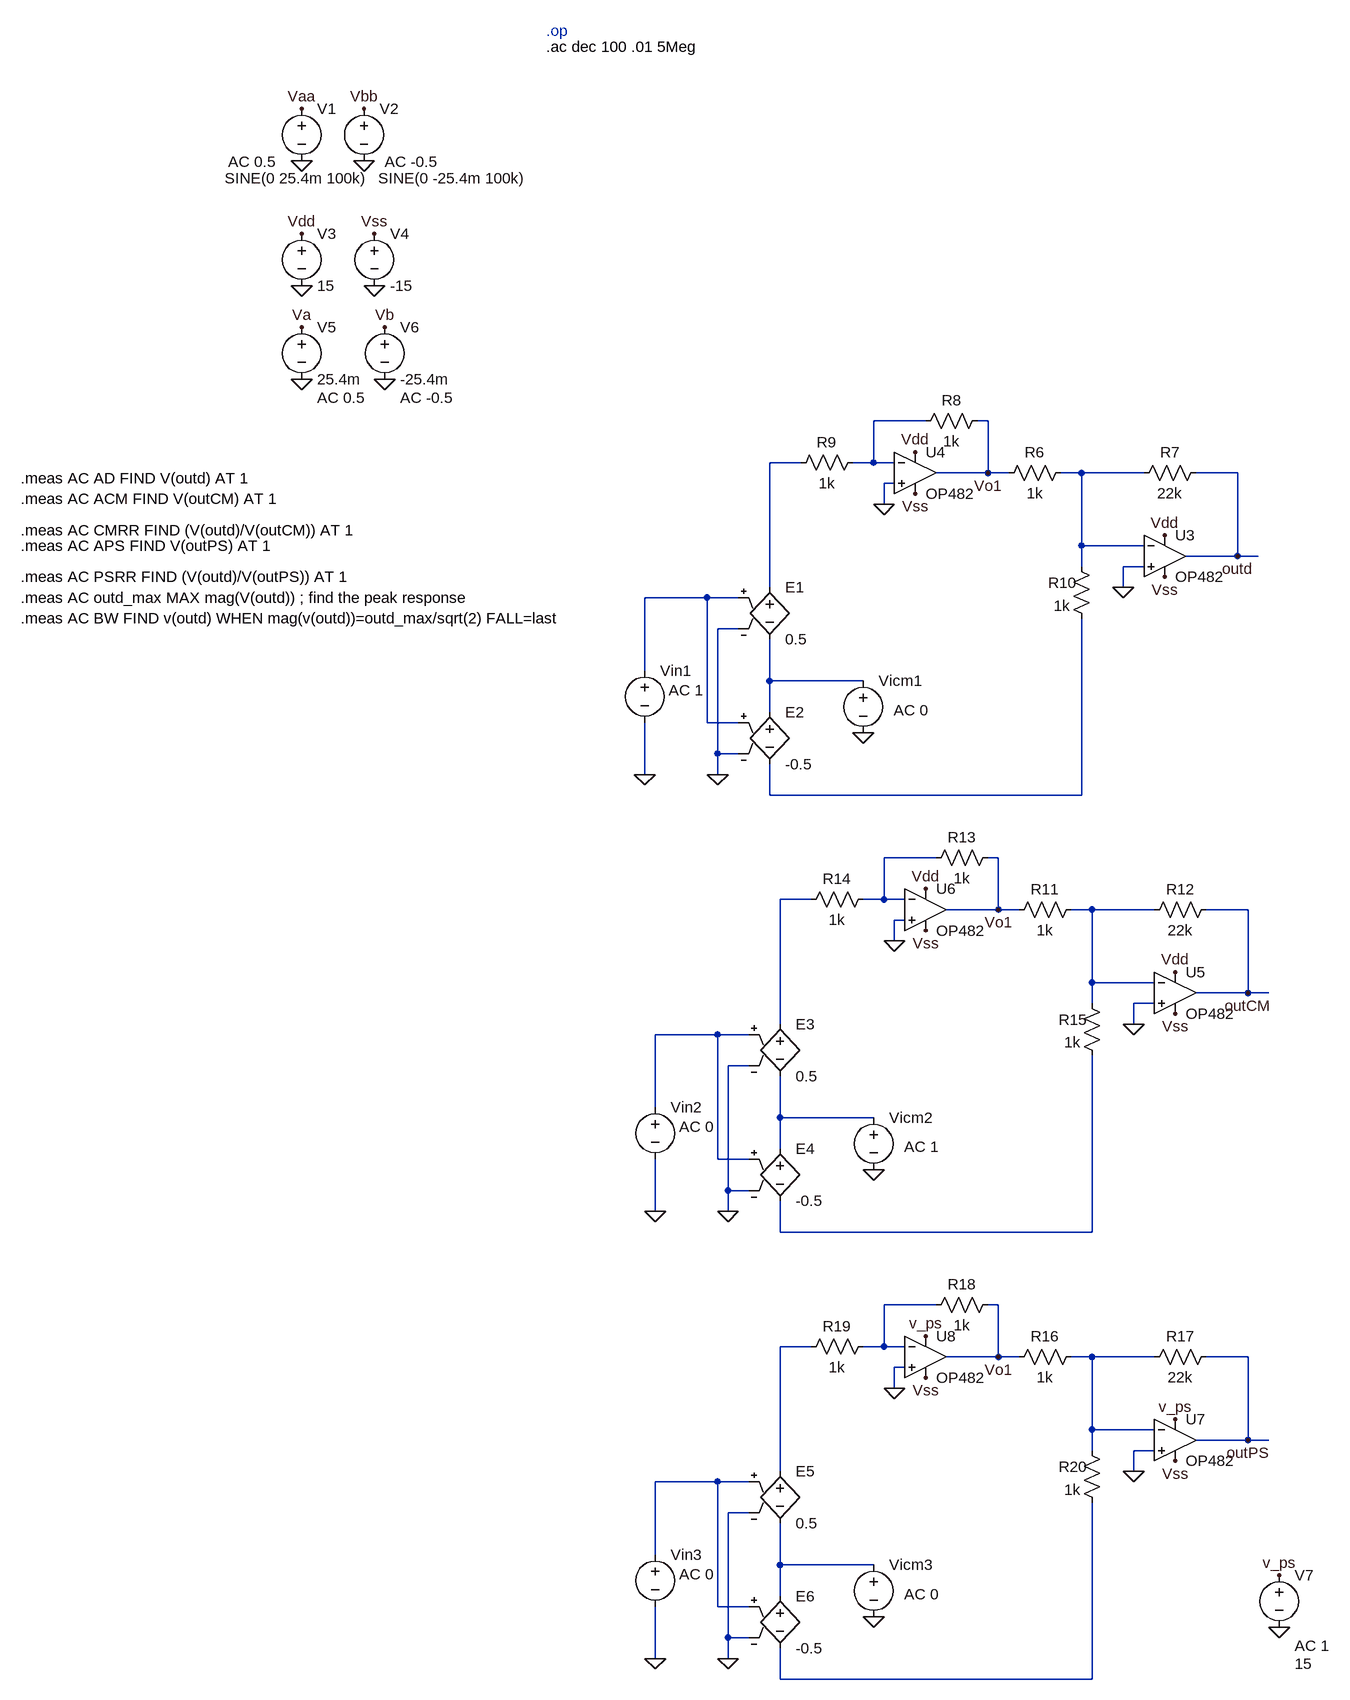
[diagram p0: schematic Et_1_CMRR+PSRR.asc]
Et_1_CMRR+PSRR.asc, the LTspice schematic file:
Version 4
SHEET 1 1392 2468
WIRE 768 528 688 528
WIRE 864 528 848 528
WIRE 576 592 528 592
WIRE 688 592 688 528
WIRE 688 592 656 592
WIRE 720 592 688 592
WIRE 864 608 864 528
WIRE 864 608 784 608
WIRE 896 608 864 608
WIRE 1008 608 976 608
WIRE 1104 608 1008 608
WIRE 1248 608 1184 608
WIRE 720 624 704 624
WIRE 704 656 704 624
WIRE 1008 720 1008 608
WIRE 1104 720 1008 720
WIRE 1248 736 1248 608
WIRE 1248 736 1168 736
WIRE 1280 736 1248 736
WIRE 1008 752 1008 720
WIRE 1104 752 1072 752
WIRE 528 784 528 592
WIRE 1072 784 1072 752
WIRE 432 800 336 800
WIRE 480 800 432 800
WIRE 480 848 448 848
WIRE 336 912 336 800
WIRE 528 928 528 864
WIRE 672 928 528 928
WIRE 528 976 528 928
WIRE 432 992 432 800
WIRE 480 992 432 992
WIRE 448 1040 448 848
WIRE 480 1040 448 1040
WIRE 336 1072 336 992
WIRE 448 1072 448 1040
WIRE 528 1104 528 1056
WIRE 1008 1104 1008 832
WIRE 1008 1104 528 1104
WIRE 784 1200 704 1200
WIRE 880 1200 864 1200
WIRE 592 1264 544 1264
WIRE 704 1264 704 1200
WIRE 704 1264 672 1264
WIRE 736 1264 704 1264
WIRE 880 1280 880 1200
WIRE 880 1280 800 1280
WIRE 912 1280 880 1280
WIRE 1024 1280 992 1280
WIRE 1120 1280 1024 1280
WIRE 1264 1280 1200 1280
WIRE 736 1296 720 1296
WIRE 720 1328 720 1296
WIRE 1024 1392 1024 1280
WIRE 1120 1392 1024 1392
WIRE 1264 1408 1264 1280
WIRE 1264 1408 1184 1408
WIRE 1296 1408 1264 1408
WIRE 1024 1424 1024 1392
WIRE 1120 1424 1088 1424
WIRE 544 1456 544 1264
WIRE 1088 1456 1088 1424
WIRE 448 1472 352 1472
WIRE 496 1472 448 1472
WIRE 496 1520 464 1520
WIRE 352 1584 352 1472
WIRE 544 1600 544 1536
WIRE 688 1600 544 1600
WIRE 544 1648 544 1600
WIRE 448 1664 448 1472
WIRE 496 1664 448 1664
WIRE 464 1712 464 1520
WIRE 496 1712 464 1712
WIRE 352 1744 352 1664
WIRE 464 1744 464 1712
WIRE 544 1776 544 1728
WIRE 1024 1776 1024 1504
WIRE 1024 1776 544 1776
WIRE 784 1888 704 1888
WIRE 880 1888 864 1888
WIRE 592 1952 544 1952
WIRE 704 1952 704 1888
WIRE 704 1952 672 1952
WIRE 736 1952 704 1952
WIRE 880 1968 880 1888
WIRE 880 1968 800 1968
WIRE 912 1968 880 1968
WIRE 1024 1968 992 1968
WIRE 1120 1968 1024 1968
WIRE 1264 1968 1200 1968
WIRE 736 1984 720 1984
WIRE 720 2016 720 1984
WIRE 1024 2080 1024 1968
WIRE 1120 2080 1024 2080
WIRE 1264 2096 1264 1968
WIRE 1264 2096 1184 2096
WIRE 1296 2096 1264 2096
WIRE 1024 2112 1024 2080
WIRE 1120 2112 1088 2112
WIRE 544 2144 544 1952
WIRE 1088 2144 1088 2112
WIRE 448 2160 352 2160
WIRE 496 2160 448 2160
WIRE 496 2208 464 2208
WIRE 352 2272 352 2160
WIRE 544 2288 544 2224
WIRE 688 2288 544 2288
WIRE 544 2336 544 2288
WIRE 448 2352 448 2160
WIRE 496 2352 448 2352
WIRE 464 2400 464 2208
WIRE 496 2400 464 2400
WIRE 352 2432 352 2352
WIRE 464 2432 464 2400
WIRE 544 2464 544 2416
WIRE 1024 2464 1024 2192
WIRE 1024 2464 544 2464
FLAG -192 128 0
FLAG -96 128 0
FLAG -192 320 0
FLAG -80 320 0
FLAG -192 48 Vaa
FLAG -96 48 Vbb
FLAG -192 240 Vdd
FLAG -80 240 Vss
FLAG 704 656 0
FLAG 1072 784 0
FLAG 752 576 Vdd
FLAG 752 640 Vss
FLAG 1136 704 Vdd
FLAG 1136 768 Vss
FLAG 864 608 Vo1
FLAG 672 1008 0
FLAG 336 1072 0
FLAG 448 1072 0
FLAG 1248 736 outd
FLAG 720 1328 0
FLAG 1088 1456 0
FLAG 768 1248 Vdd
FLAG 768 1312 Vss
FLAG 1152 1376 Vdd
FLAG 1152 1440 Vss
FLAG 880 1280 Vo1
FLAG 688 1680 0
FLAG 352 1744 0
FLAG 464 1744 0
FLAG 1264 1408 outCM
FLAG 720 2016 0
FLAG 1088 2144 0
FLAG 768 2000 Vss
FLAG 1152 2128 Vss
FLAG 880 1968 Vo1
FLAG 688 2368 0
FLAG 352 2432 0
FLAG 464 2432 0
FLAG 1264 2096 outPS
FLAG 1312 2384 0
FLAG 1312 2304 v_ps
FLAG 1152 2064 v_ps
FLAG 768 1936 v_ps
FLAG -192 384 Va
FLAG -64 384 Vb
FLAG -192 464 0
FLAG -64 464 0
SYMBOL voltage -192 32 R0
WINDOW 3 -118 123 Left 2
WINDOW 123 -113 97 Left 2
WINDOW 39 0 0 Left 0
SYMATTR Value SINE(0 25.4m 100k)
SYMATTR Value2 AC 0.5
SYMATTR InstName V1
SYMBOL voltage -96 32 R0
WINDOW 3 22 123 Left 2
WINDOW 123 32 97 Left 2
WINDOW 39 0 0 Left 0
SYMATTR Value SINE(0 -25.4m 100k)
SYMATTR Value2 AC -0.5
SYMATTR InstName V2
SYMBOL voltage -192 224 R0
WINDOW 123 0 0 Left 0
WINDOW 39 0 0 Left 0
SYMATTR InstName V3
SYMATTR Value 15
SYMBOL voltage -80 224 R0
WINDOW 123 0 0 Left 0
WINDOW 39 0 0 Left 0
SYMATTR InstName V4
SYMATTR Value -15
SYMBOL OpAmps\\OP482 1136 672 R0
SYMATTR InstName U3
SYMBOL res 992 592 R90
WINDOW 0 0 56 VBottom 2
WINDOW 3 32 56 VTop 2
SYMATTR InstName R6
SYMATTR Value 1k
SYMBOL res 1200 592 R90
WINDOW 0 0 56 VBottom 2
WINDOW 3 32 56 VTop 2
SYMATTR InstName R7
SYMATTR Value 22k
SYMBOL OpAmps\\OP482 752 544 R0
SYMATTR InstName U4
SYMBOL res 864 512 R90
WINDOW 0 0 56 VBottom 2
WINDOW 3 32 56 VTop 2
SYMATTR InstName R8
SYMATTR Value 1k
SYMBOL res 560 608 R270
WINDOW 0 32 56 VTop 2
WINDOW 3 0 56 VBottom 2
SYMATTR InstName R9
SYMATTR Value 1k
SYMBOL res 992 736 R0
WINDOW 0 -35 41 Left 2
WINDOW 3 -27 76 Left 2
SYMATTR InstName R10
SYMATTR Value 1k
SYMBOL e 528 768 R0
SYMATTR InstName E1
SYMATTR Value 0.5
SYMBOL e 528 960 R0
SYMATTR InstName E2
SYMATTR Value -0.5
SYMBOL voltage 672 912 R0
WINDOW 123 47 61 Left 2
WINDOW 39 0 0 Left 0
SYMATTR Value2 AC 0
SYMATTR InstName Vicm1
SYMATTR Value ""
SYMBOL voltage 336 896 R0
WINDOW 123 37 46 Left 2
WINDOW 39 0 0 Left 0
SYMATTR Value2 AC 1
SYMATTR InstName Vin1
SYMATTR Value ""
SYMBOL OpAmps\\OP482 1152 1344 R0
SYMATTR InstName U5
SYMBOL res 1008 1264 R90
WINDOW 0 0 56 VBottom 2
WINDOW 3 32 56 VTop 2
SYMATTR InstName R11
SYMATTR Value 1k
SYMBOL res 1216 1264 R90
WINDOW 0 0 56 VBottom 2
WINDOW 3 32 56 VTop 2
SYMATTR InstName R12
SYMATTR Value 22k
SYMBOL OpAmps\\OP482 768 1216 R0
SYMATTR InstName U6
SYMBOL res 880 1184 R90
WINDOW 0 0 56 VBottom 2
WINDOW 3 32 56 VTop 2
SYMATTR InstName R13
SYMATTR Value 1k
SYMBOL res 576 1280 R270
WINDOW 0 32 56 VTop 2
WINDOW 3 0 56 VBottom 2
SYMATTR InstName R14
SYMATTR Value 1k
SYMBOL res 1008 1408 R0
WINDOW 0 -35 41 Left 2
WINDOW 3 -27 76 Left 2
SYMATTR InstName R15
SYMATTR Value 1k
SYMBOL e 544 1440 R0
SYMATTR InstName E3
SYMATTR Value 0.5
SYMBOL e 544 1632 R0
SYMATTR InstName E4
SYMATTR Value -0.5
SYMBOL voltage 688 1584 R0
WINDOW 123 47 61 Left 2
WINDOW 39 0 0 Left 0
SYMATTR Value2 AC 1
SYMATTR InstName Vicm2
SYMATTR Value ""
SYMBOL voltage 352 1568 R0
WINDOW 123 37 46 Left 2
WINDOW 39 0 0 Left 0
SYMATTR Value2 AC 0
SYMATTR InstName Vin2
SYMATTR Value ""
SYMBOL OpAmps\\OP482 1152 2032 R0
SYMATTR InstName U7
SYMBOL res 1008 1952 R90
WINDOW 0 0 56 VBottom 2
WINDOW 3 32 56 VTop 2
SYMATTR InstName R16
SYMATTR Value 1k
SYMBOL res 1216 1952 R90
WINDOW 0 0 56 VBottom 2
WINDOW 3 32 56 VTop 2
SYMATTR InstName R17
SYMATTR Value 22k
SYMBOL OpAmps\\OP482 768 1904 R0
SYMATTR InstName U8
SYMBOL res 880 1872 R90
WINDOW 0 0 56 VBottom 2
WINDOW 3 32 56 VTop 2
SYMATTR InstName R18
SYMATTR Value 1k
SYMBOL res 576 1968 R270
WINDOW 0 32 56 VTop 2
WINDOW 3 0 56 VBottom 2
SYMATTR InstName R19
SYMATTR Value 1k
SYMBOL res 1008 2096 R0
WINDOW 0 -35 41 Left 2
WINDOW 3 -27 76 Left 2
SYMATTR InstName R20
SYMATTR Value 1k
SYMBOL e 544 2128 R0
SYMATTR InstName E5
SYMATTR Value 0.5
SYMBOL e 544 2320 R0
SYMATTR InstName E6
SYMATTR Value -0.5
SYMBOL voltage 688 2272 R0
WINDOW 123 47 61 Left 2
WINDOW 39 0 0 Left 0
SYMATTR Value2 AC 0
SYMATTR InstName Vicm3
SYMATTR Value ""
SYMBOL voltage 352 2256 R0
WINDOW 123 37 46 Left 2
WINDOW 39 0 0 Left 0
SYMATTR Value2 AC 0
SYMATTR InstName Vin3
SYMATTR Value ""
SYMBOL voltage 1312 2288 R0
WINDOW 3 24 152 Left 2
WINDOW 123 24 124 Left 2
WINDOW 39 0 0 Left 0
SYMATTR Value 15
SYMATTR Value2 AC 1
SYMATTR InstName V7
SYMBOL voltage -192 368 R0
WINDOW 123 24 124 Left 2
WINDOW 39 0 0 Left 0
SYMATTR Value2 AC 0.5
SYMATTR InstName V5
SYMATTR Value 25.4m
SYMBOL voltage -64 368 R0
WINDOW 123 24 124 Left 2
WINDOW 39 0 0 Left 0
SYMATTR Value2 AC -0.5
SYMATTR InstName V6
SYMATTR Value -25.4m
TEXT 184 -72 Left 2 ;.op
TEXT 184 -48 Left 2 !.ac dec 100 .01 5Meg
TEXT -624 616 Left 2 !.meas AC AD FIND V(outd) AT 1
TEXT -624 648 Left 2 !.meas AC ACM FIND V(outCM) AT 1
TEXT -624 696 Left 2 !.meas AC CMRR FIND (V(outd)/V(outCM)) AT 1
TEXT -624 720 Left 2 !.meas AC APS FIND V(outPS) AT 1
TEXT -624 768 Left 2 !.meas AC PSRR FIND (V(outd)/V(outPS)) AT 1
TEXT -624 800 Left 2 !.meas AC outd_max MAX mag(V(outd)) ; find the peak response\n.meas AC BW FIND v(outd) WHEN mag(v(outd))=outd_max/sqrt(2) FALL=last

The netlist it stands for:
* Et_1_CMRR+PSRR.asc
V1 Vaa 0 SINE(0 25.4m 100k) AC 0.5
V2 Vbb 0 SINE(0 -25.4m 100k) AC -0.5
V3 Vdd 0 15
V4 Vss 0 -15
XU3 0 N003 Vdd Vss outd OP482  ; pins In+ In- V+ V- OUT
R6 N003 Vo1 1k
R7 outd N003 22k
XU4 0 N001 Vdd Vss Vo1 OP482  ; pins In+ In- V+ V- OUT
R8 Vo1 N001 1k
R9 N002 N001 1k
R10 N003 N006 1k
E1 N002 N005 N004 0 0.5
E2 N005 N006 N004 0 -0.5
Vicm1 N005 0 AC 0
Vin1 N004 0 AC 1
XU5 0 N009 Vdd Vss outCM OP482  ; pins In+ In- V+ V- OUT
R11 N009 Vo1 1k
R12 outCM N009 22k
XU6 0 N007 Vdd Vss Vo1 OP482  ; pins In+ In- V+ V- OUT
R13 Vo1 N007 1k
R14 N008 N007 1k
R15 N009 N012 1k
E3 N008 N011 N010 0 0.5
E4 N011 N012 N010 0 -0.5
Vicm2 N011 0 AC 1
Vin2 N010 0 AC 0
XU7 0 N015 v_ps Vss outPS OP482  ; pins In+ In- V+ V- OUT
R16 N015 Vo1 1k
R17 outPS N015 22k
XU8 0 N013 v_ps Vss Vo1 OP482  ; pins In+ In- V+ V- OUT
R18 Vo1 N013 1k
R19 N014 N013 1k
R20 N015 N018 1k
E5 N014 N017 N016 0 0.5
E6 N017 N018 N016 0 -0.5
Vicm3 N017 0 AC 0
Vin3 N016 0 AC 0
V7 v_ps 0 15 AC 1
V5 Va 0 25.4m AC 0.5
V6 Vb 0 -25.4m AC -0.5
* .op
.ac dec 100 .01 5Meg
.meas AC AD FIND V(outd) AT 1
.meas AC ACM FIND V(outCM) AT 1
.meas AC CMRR FIND (V(outd)/V(outCM)) AT 1
.meas AC APS FIND V(outPS) AT 1
.meas AC PSRR FIND (V(outd)/V(outPS)) AT 1
.meas AC outd_max MAX mag(V(outd)) ; find the peak response
.meas AC BW FIND v(outd) WHEN mag(v(outd))=outd_max/sqrt(2) FALL=last
.backanno
.end